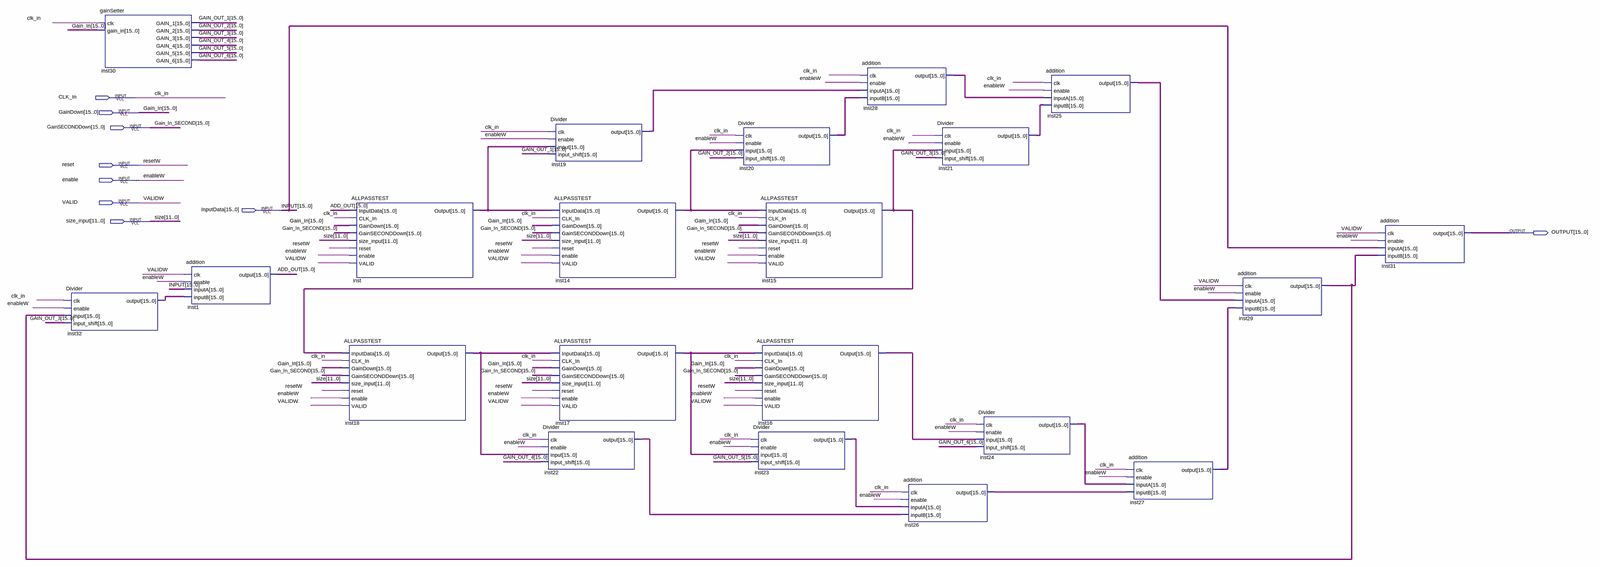
[diagram p0: schematic sheet, whole]
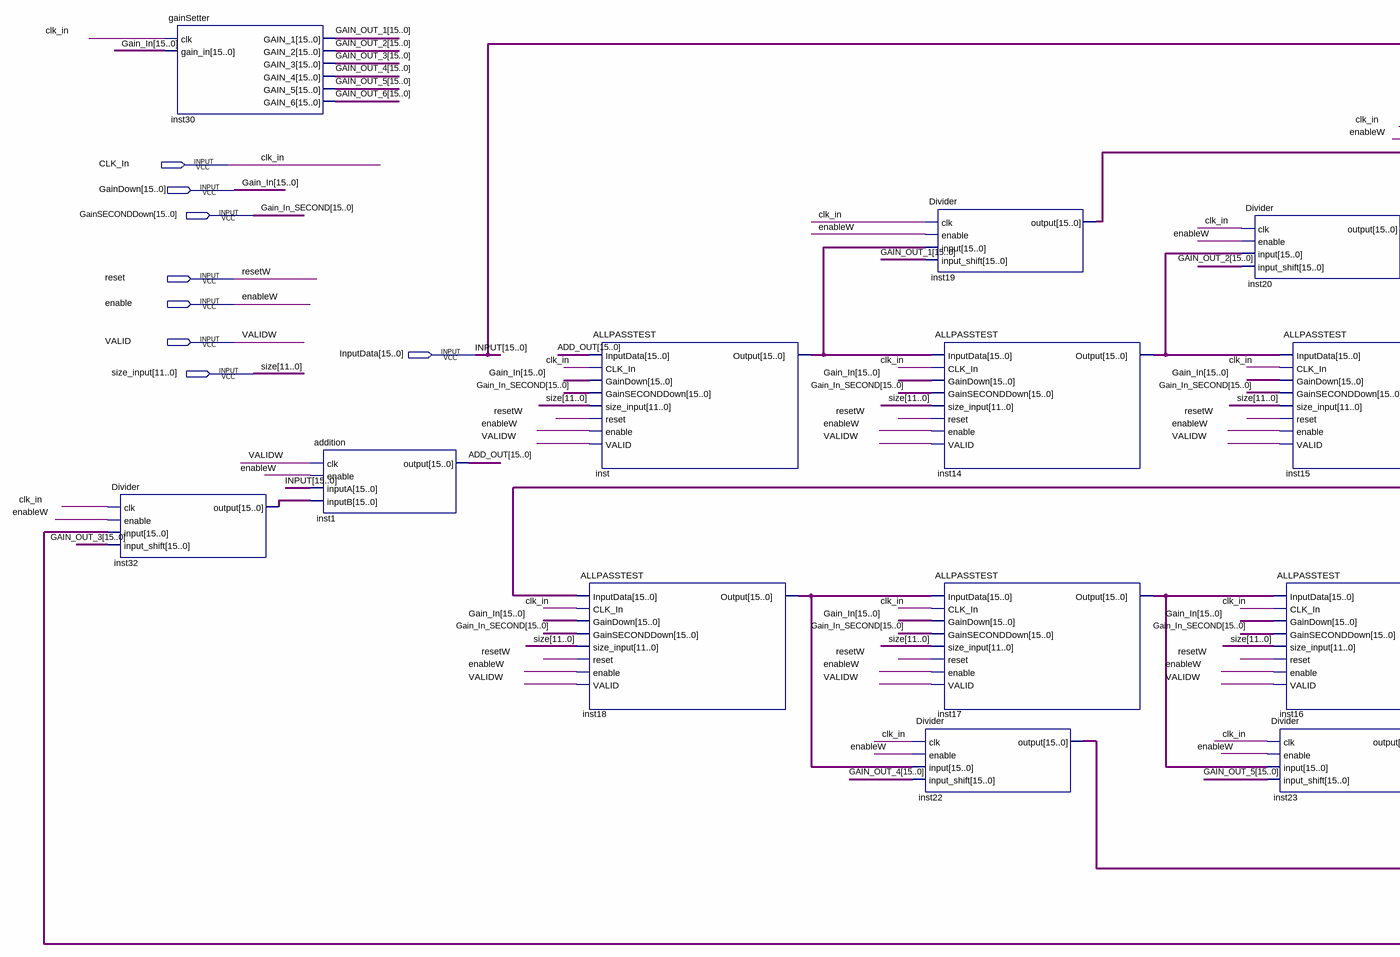
[diagram p1: schematic sheet, left part]
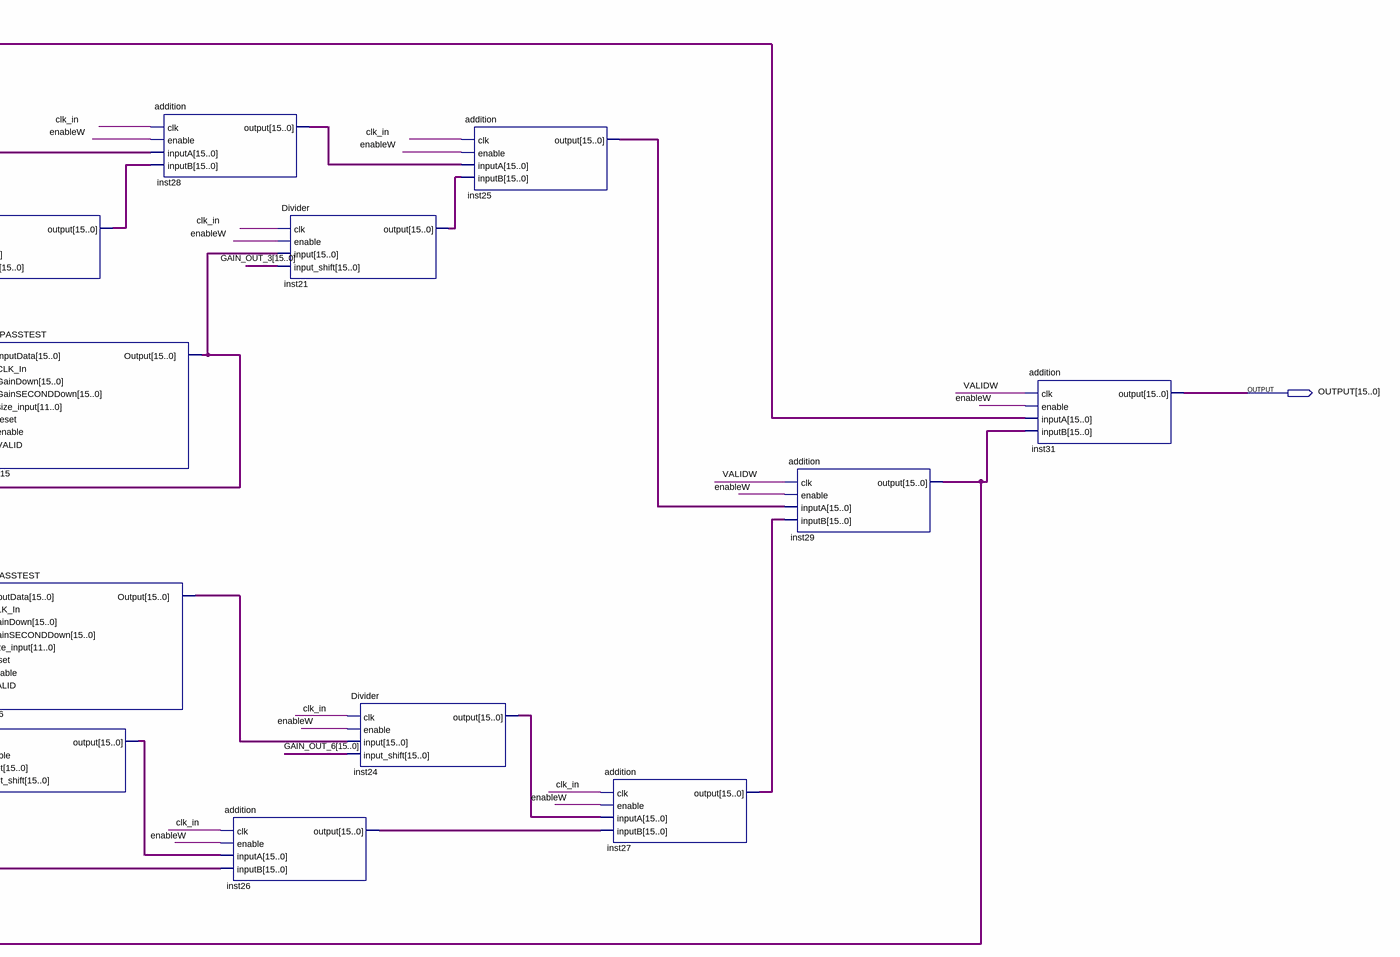
[diagram p2: schematic sheet, right part]
// Quartus schematic RoomSimulator.bdf as structural Verilog: 21 symbols, 9 pins
module RoomSimulator (
  input  CLK_In,
  input  [15:0] GainDown,
  input  [15:0] GainSECONDDown,
  input  reset,
  input  enable,
  input  VALID,
  input  [15:0] InputData,
  input  [11:0] size_input,
  output [15:0] OUTPUT
);

  wire [15:0] ADD_OUT, GAIN_OUT_1, GAIN_OUT_2, GAIN_OUT_3, GAIN_OUT_4, GAIN_OUT_5, GAIN_OUT_6, inst14_output,
       inst15_output, inst16_output, inst17_output, inst18_output, inst19_output, inst20_output,
       inst21_output, inst22_output, inst23_output, inst24_output, inst25_output, inst26_output,
       inst27_output, inst28_output, inst29_output, inst32_output, inst_output;

  Divider inst32 (
    .clk(CLK_In), .enable(enable), .\input (inst29_output), .input_shift(GAIN_OUT_3), .\output (inst32_output));
  gainSetter inst30 (
    .clk(CLK_In), .gain_in(GainDown), .GAIN_1(GAIN_OUT_1), .GAIN_2(GAIN_OUT_2), .GAIN_3(GAIN_OUT_3),
    .GAIN_4(GAIN_OUT_4), .GAIN_5(GAIN_OUT_5), .GAIN_6(GAIN_OUT_6));
  addition inst1 (.clk(VALID), .enable(enable), .inputA(InputData), .inputB(inst32_output), .\output (ADD_OUT));
  ALLPASSTEST inst (
    .InputData(ADD_OUT), .CLK_In(CLK_In), .GainDown(GainDown), .GainSECONDDown(GainSECONDDown),
    .size_input(size_input), .reset(reset), .enable(enable), .VALID(VALID), .Output(inst_output));
  ALLPASSTEST inst18 (
    .InputData(inst15_output), .CLK_In(CLK_In), .GainDown(GainDown), .GainSECONDDown(GainSECONDDown),
    .size_input(size_input), .reset(reset), .enable(enable), .VALID(VALID), .Output(inst18_output));
  Divider inst19 (
    .clk(CLK_In), .enable(enable), .\input (inst_output), .input_shift(GAIN_OUT_1), .\output (inst19_output));
  ALLPASSTEST inst14 (
    .InputData(inst_output), .CLK_In(CLK_In), .GainDown(GainDown), .GainSECONDDown(GainSECONDDown),
    .size_input(size_input), .reset(reset), .enable(enable), .VALID(VALID), .Output(inst14_output));
  ALLPASSTEST inst17 (
    .InputData(inst18_output), .CLK_In(CLK_In), .GainDown(GainDown), .GainSECONDDown(GainSECONDDown),
    .size_input(size_input), .reset(reset), .enable(enable), .VALID(VALID), .Output(inst17_output));
  Divider inst22 (
    .clk(CLK_In), .enable(enable), .\input (inst18_output), .input_shift(GAIN_OUT_4), .\output (inst22_output));
  Divider inst20 (
    .clk(CLK_In), .enable(enable), .\input (inst14_output), .input_shift(GAIN_OUT_2), .\output (inst20_output));
  ALLPASSTEST inst15 (
    .InputData(inst14_output), .CLK_In(CLK_In), .GainDown(GainDown), .GainSECONDDown(GainSECONDDown),
    .size_input(size_input), .reset(reset), .enable(enable), .VALID(VALID), .Output(inst15_output));
  ALLPASSTEST inst16 (
    .InputData(inst17_output), .CLK_In(CLK_In), .GainDown(GainDown), .GainSECONDDown(GainSECONDDown),
    .size_input(size_input), .reset(reset), .enable(enable), .VALID(VALID), .Output(inst16_output));
  Divider inst23 (
    .clk(CLK_In), .enable(enable), .\input (inst17_output), .input_shift(GAIN_OUT_5), .\output (inst23_output));
  addition inst28 (
    .clk(CLK_In), .enable(enable), .inputA(inst19_output), .inputB(inst20_output), .\output (inst28_output));
  addition inst26 (
    .clk(CLK_In), .enable(enable), .inputA(inst23_output), .inputB(inst22_output), .\output (inst26_output));
  Divider inst21 (
    .clk(CLK_In), .enable(enable), .\input (inst15_output), .input_shift(GAIN_OUT_3), .\output (inst21_output));
  Divider inst24 (
    .clk(CLK_In), .enable(enable), .\input (inst16_output), .input_shift(GAIN_OUT_6), .\output (inst24_output));
  addition inst25 (
    .clk(CLK_In), .enable(enable), .inputA(inst28_output), .inputB(inst21_output), .\output (inst25_output));
  addition inst27 (
    .clk(CLK_In), .enable(enable), .inputA(inst24_output), .inputB(inst26_output), .\output (inst27_output));
  addition inst29 (
    .clk(VALID), .enable(enable), .inputA(inst25_output), .inputB(inst27_output), .\output (inst29_output));
  addition inst31 (.clk(VALID), .enable(enable), .inputA(InputData), .inputB(inst29_output), .\output (OUTPUT));

  // Other names for the same wires on the sheet: enableW = enable; Gain_In[15:0] = GainDown;
  //   Gain_In_SECOND[15:0] = GainSECONDDown; INPUT[15:0] = InputData; resetW = reset; size[11:0] = size_input;
  //   VALIDW = VALID
endmodule
